# Altium schematic sheet Power_Supply.SchDoc
size A4; SheetNumber: 1; SheetTotal: 7
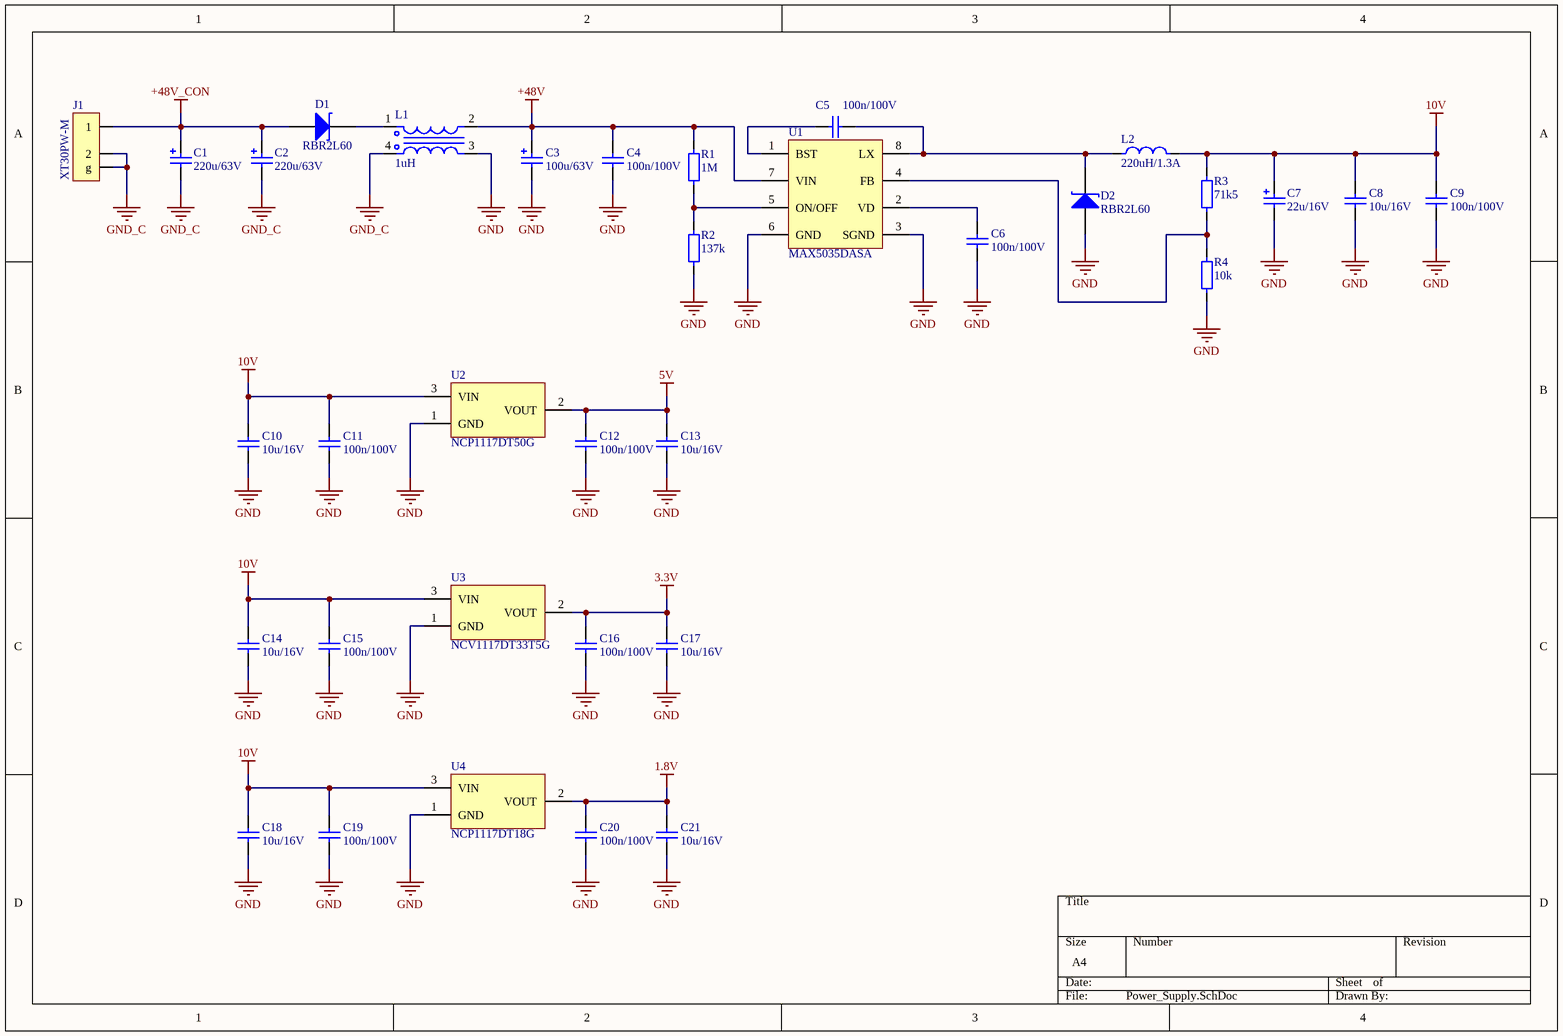
[diagram p0: Power_Supply.SchDoc]

## Parts
C1  220u/63V  [CAP_POL_10x20]
C2  220u/63V  [CAP_POL_10x20]
C3  100u/63V  [CAP_POL_10x12]
C4  value 100n/100V  [CAP_0805N]  (hidden comment: 100n/100V/0805)
C5  value 100n/100V  [CAP_0805N]  (hidden comment: 100n/100V/0805)
C6  value 100n/100V  [CAP_0805N]  (hidden comment: 100n/100V/0805)
C7  22u/16V  [CAPCP3528X20N]
C8  value 10u/16V  [CAP_0805N]  (hidden comment: 10u/16V/0805)
C9  value 100n/100V  [CAP_0805N]  (hidden comment: 100n/100V/0805)
C10  value 10u/16V  [CAP_0805N]  (hidden comment: 10u/16V/0805)
C11  value 100n/100V  [CAP_0805N]  (hidden comment: 100n/100V/0805)
C12  value 100n/100V  [CAP_0805N]  (hidden comment: 100n/100V/0805)
C13  value 10u/16V  [CAP_0805N]  (hidden comment: 10u/16V/0805)
C14  value 10u/16V  [CAP_0805N]  (hidden comment: 10u/16V/0805)
C15  value 100n/100V  [CAP_0805N]  (hidden comment: 100n/100V/0805)
C16  value 100n/100V  [CAP_0805N]  (hidden comment: 100n/100V/0805)
C17  value 10u/16V  [CAP_0805N]  (hidden comment: 10u/16V/0805)
C18  value 10u/16V  [CAP_0805N]  (hidden comment: 10u/16V/0805)
C19  value 100n/100V  [CAP_0805N]  (hidden comment: 100n/100V/0805)
C20  value 100n/100V  [CAP_0805N]  (hidden comment: 100n/100V/0805)
C21  value 10u/16V  [CAP_0805N]  (hidden comment: 10u/16V/0805)
D1  RBR2L60  [DO-214AC]
D2  RBR2L60  [DO-214AC]
J1  XT30PW-M  [XT30_PCB]
L1  1uH  [744235601]
L2  220uH/1.3A  [INDP125125X65N]
R1  value 1M  [RES_0805N]  (hidden comment: 1M/0805)
R2  value 137k  [RES_0805N]  (hidden comment: 137k/0805)
R3  value 71k5  [RES_0805N]  (hidden comment: 137k/0805)
R4  value 10k  [RES_0805N]  (hidden comment: 137k/0805)
U1  MAX5035DASA  [SOIC-8]
U2  NCP1117DT50G  [NCP1117DT50G]
U3  NCV1117DT33T5G  [NCV1117DT33T5G]
U4  NCP1117DT18G  [NCV1117DT33T5G]

## Nets
1.8V: C20.2 C21.2 U4.2(VOUT)
3.3V: C16.2 C17.2 U3.2(VOUT)
5V: C12.2 C13.2 U2.2(VOUT)
10V: C7.2 C8.2 C9.2 C10.2 C11.2 C14.2 C15.2 C18.2 C19.2 L2.2 R3.2 U2.3(VIN) U3.3(VIN) U4.3(VIN)
+48V: C3.2 C4.2 L1.2 R1.2 U1.7(VIN)
+48V_CON: C1.2 C2.2 D1.1(A) J1.1
GND: C3.1 C4.1 C6.1 C7.1 C8.1 C9.1 C10.1 C11.1 C12.1 C13.1 C14.1 C15.1 C16.1 C17.1 C18.1 C19.1 C20.1 C21.1 D2.1(A) L1.3 R2.1 R4.1 U1.3(SGND) U1.6(GND) U2.1(GND) U3.1(GND) U4.1(GND)
GND_C: C1.1 C2.1 J1.2 J1.g L1.4
NetC5_1: C5.1 D2.2(K) L2.1 U1.8(LX)
NetC5_2: C5.2 U1.1(BST)
NetC6_2: C6.2 U1.2(VD)
NetD1_2: D1.2(K) L1.1
NetR1_1: R1.1 R2.2 U1.5(ON/OFF)
NetR3_1: R3.1 R4.2 U1.4(FB)

## Library data of the parts
C1 C2 = CAP_POL/220u/63V: Aluminum Electrolytic Capacitors - Radial Leaded 220uF 63V 20% Radial; Manufacturer: Murata; Part Number: GRM31CR61A107ME05L; Distributor: Mouser; Distributor ID: 81-GRM31CR61A107ME5L; Value: 220u/63V
C3 = CAP_POL/100u/63V: Aluminum Electrolytic Capacitors - Radial Leaded WCAP-ATUL 100uF 63V 20% Radial; Manufacturer: Murata; Part Number: GRM31CR61A107ME05L; Distributor: Mouser; Distributor ID: 81-GRM31CR61A107ME5L; Value: 100u/63V
C4-C6 C9 C11 C12 C15 C16 C19 C20 = CAP_MLCC/100n/100V/0805: Multilayer Ceramic Capacitors MLCC - SMD/SMT 100V 0.1uF X7R 0805 10%; Manufacturer: KEMET; Part Number: C0805C104J5RACTU; Distributor: Mouser; Distributor ID: 80-C0805C104J5R
C7 = CAP_POL/22u/16V: Tantalum Capacitors - Solid SMD 22uF 16V 10% L ESR; Manufacturer: Murata; Part Number: GRM31CR61A107ME05L; Distributor: Mouser; Distributor ID: 81-GRM31CR61A107ME5L; Value: 22u/16V
C8 C10 C13 C14 C17 C18 C21 = CAP_MLCC/10u/16V/0805: Multilayer Ceramic Capacitors MLCC - SMD/SMT 10UF 16V 10% 0805; Manufacturer: Murata; Part Number: C0805C106K8PACTU; Distributor: Mouser; Distributor ID: 80-C0805C106K8P
D1 D2 = RBR2L60: Schottky Diodes & Rectifiers SCHOTTKY BARRIER DIODE; Manufacturer: ROHM Semiconductor; Part Number: RBR2L60ADDTE25; Distributor: Mouser; Distributor ID: 755-RBR2L60ADDTE25
J1 = XT30_PCB: Gniazdo; zasilające DC; XT30; męskie; PIN: 2; na PCB; THT; 15A; 500V
L1 = CMC_744235601: Common Mode Chokes / Filters WE-CNSW 1812 1200mA 1uH 100kHz AECQ200; Manufacturer: Würth Elektronik; Part Number: 744282010; Distributor 1: Digikey; Distributor 1 ID: 732-2965-1-ND; Second Source: *; Value: 1uH
L2 = SRR1260-221K: Fixed Inductors 220uH 10% SMD 1260; Manufacturer: Bourns; Distributor: Mouser; Distributor ID: 652-SRR1260-221K; Part Number: SRR1260-221K
R1 = RES/1M/1%/0805: Thick Film Resistors - SMD .125watt 1Mohms 1% 0805 100ppm; Manufacturer: Vishay; Part Number: CRCW080510R0FKEAC; Distributor: Mouser; Distributor ID: 71-CRCW080510R0FKEAC
R2-R4 = RES/137k/1%/0805: Thick Film Resistors - SMD 1/8Watt 137kohms 1% Commercial Use; Manufacturer: Vishay; Part Number: CRCW080510R0FKEAC; Distributor: Mouser; Distributor ID: 71-CRCW080510R0FKEAC
U1 = MAX5035DASA: Switching Voltage Regulators 1A, 76V, High-Efficiency MAXPower Step-Down DC-DC Converter / MAX5035DASA; Manufacturer: Maxim Integrated; Part Number: MAX5035DASA+; Distributor: Mouser; Distributor ID: 700-MAX5035DASA
U2 = NCP1117DT50G: NCP1117DT50G / LDO 5V 1A
U3 = NCV1117DT33T5G: LDO 3.3V / NCV1117DT33T5G
U4 = NCP1117DT18RKG: NCP1117DT18RKG / LDO 1,8V 1A